# Altium schematic sheet STM32G431RBT6.SchDoc
size 304 x 254 mm; Organization: Efficient Power Conversion; Address1: 909 N. Pacific Coast Hwy. Ste 230; Address2: El Segundo, CA 90245; Address3: U.S.A.; Address4: www.epc-co.com; DocumentNumber: 1; Revision: 1; SheetNumber: 1; SheetTotal: 1
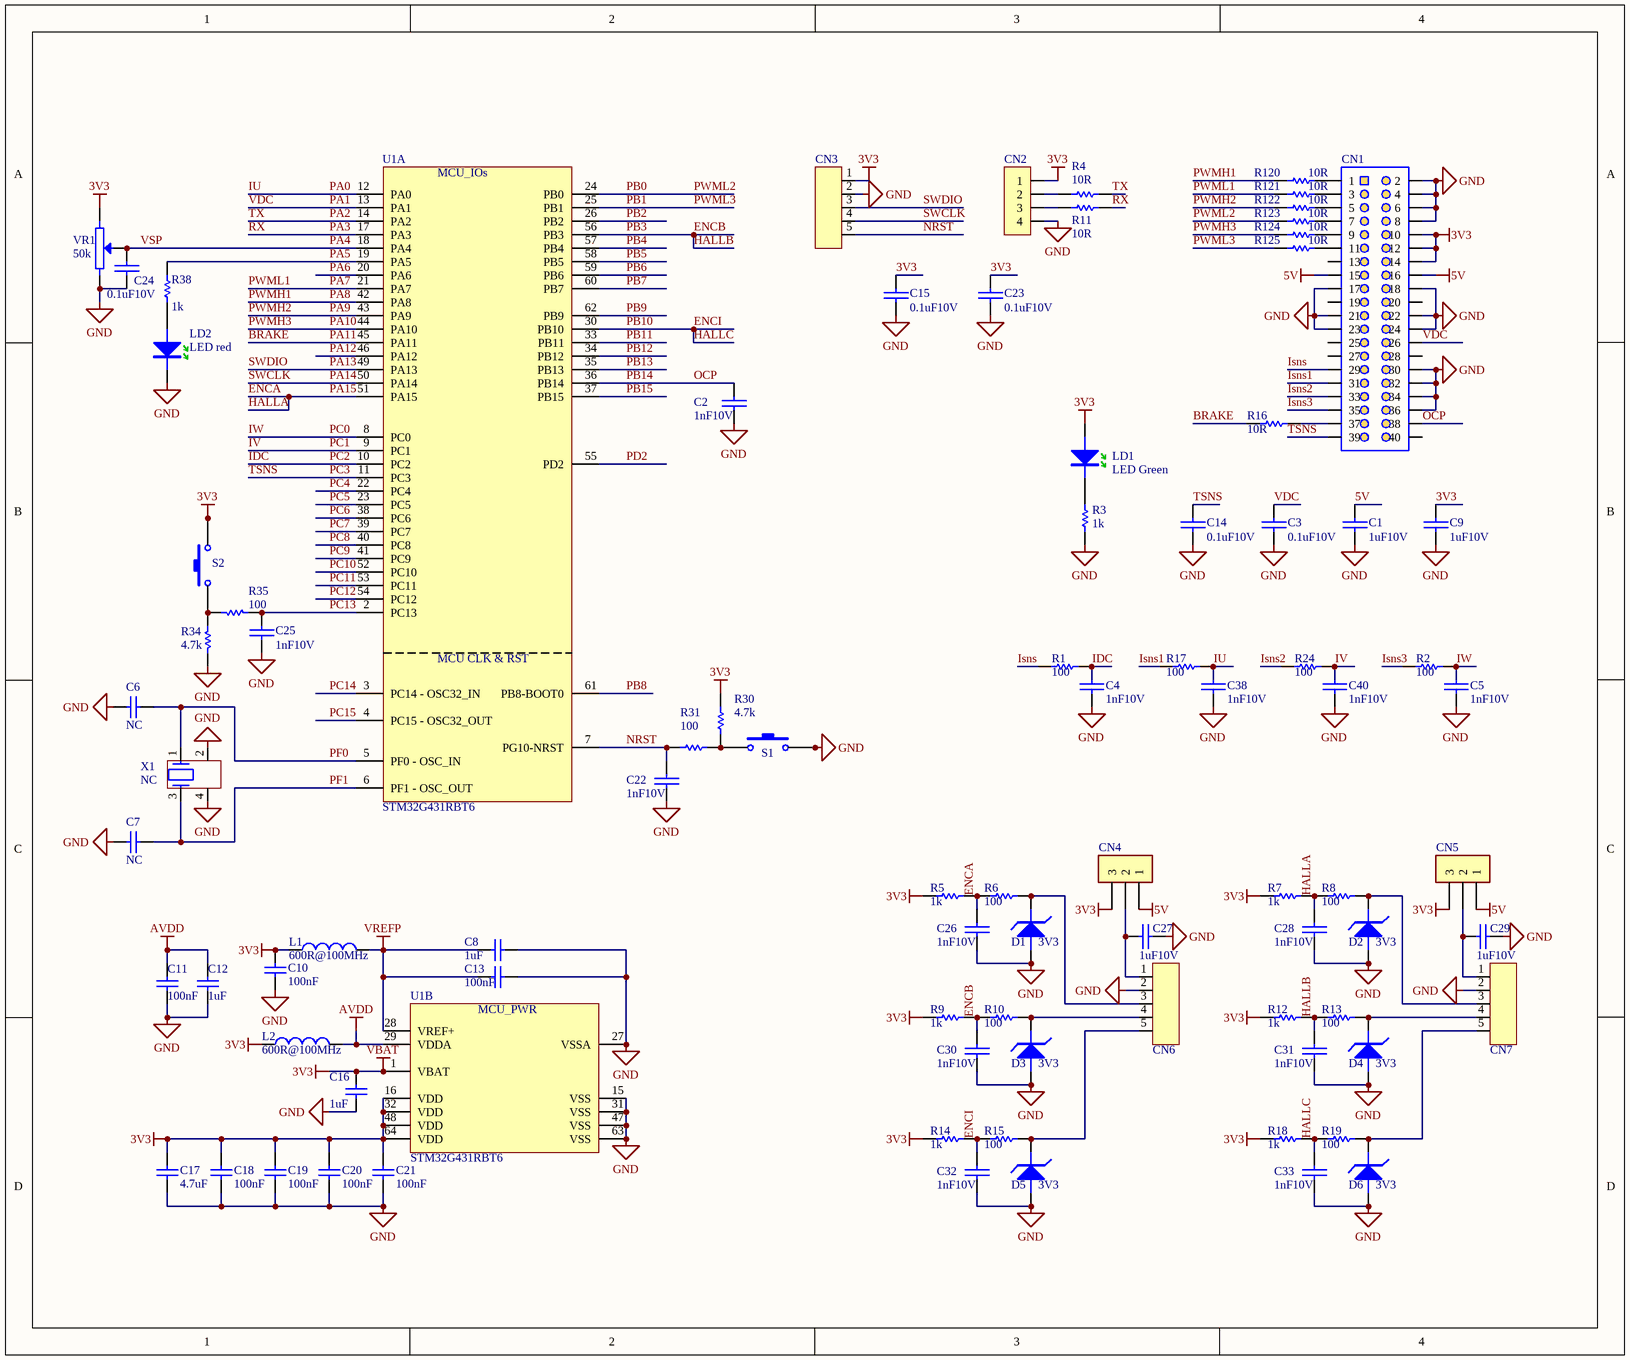
[diagram p0: STM32G431RBT6.SchDoc]

## Parts
C1  SchDescript: 1uF10V  [CC0603]  (hidden comment: UMK107AB7105KA-T)
C2  SchDescript: 1nF10V  [CC0402]  (hidden comment: C0402C102J5GACTU)
C3  SchDescript: 0.1uF10V  [CC0603]  (hidden comment: CC0402KRX7R8BB104)
C4  SchDescript: 1nF10V  [CC0402]  (hidden comment: C0402C102J5GACTU)
C5  SchDescript: 1nF10V  [CC0402]  (hidden comment: C0402C102J5GACTU)
C6  value NC  [CC0402]
C7  value NC  [CC0402]
C8  value 1uF  [CC0603]
C9  SchDescript: 1uF10V  [CC0603]  (hidden comment: UMK107AB7105KA-T)
C10  value 100nF  [CC0402]
C11  value 100nF  [CC0402]
C12  value 1uF  [CC0603]
C13  value 100nF  [CC0402]
C14  SchDescript: 0.1uF10V  [CC0603]  (hidden comment: CC0402KRX7R8BB104)
C15  SchDescript: 0.1uF10V  [CC0402]  (hidden comment: CC0402KRX7R8BB104)
C16  value 1uF  [CC0603]
C17  value 4.7uF  [CC0603]
C18  value 100nF  [CC0402]
C19  value 100nF  [CC0402]
C20  value 100nF  [CC0402]
C21  value 100nF  [CC0402]
C22  SchDescript: 1nF10V  [CC0402]  (hidden comment: CC0402KRX7R8BB104)
C23  SchDescript: 0.1uF10V  [CC0402]  (hidden comment: CC0402KRX7R8BB104)
C24  SchDescript: 0.1uF10V  [CC0402]  (hidden comment: CC0402KRX7R8BB104)
C25  SchDescript: 1nF10V  [CC0402]  (hidden comment: CC0402KRX7R8BB104)
C26  SchDescript: 1nF10V  [CC0402]  (hidden comment: C0402C102J5GACTU)
C27  1uF10V  [0603C]
C28  SchDescript: 1nF10V  [CC0402]  (hidden comment: C0402C102J5GACTU)
C29  1uF10V  [0603C]
C30  SchDescript: 1nF10V  [CC0402]  (hidden comment: C0402C102J5GACTU)
C31  SchDescript: 1nF10V  [CC0402]  (hidden comment: C0402C102J5GACTU)
C32  SchDescript: 1nF10V  [CC0402]  (hidden comment: C0402C102J5GACTU)
C33  SchDescript: 1nF10V  [CC0402]  (hidden comment: C0402C102J5GACTU)
C38  SchDescript: 1nF10V  [CC0402]  (hidden comment: C0402C102J5GACTU)
C40  SchDescript: 1nF10V  [CC0402]  (hidden comment: C0402C102J5GACTU)
CN1  SFH11-PBPC-D17-ST-BK  [HDR_F10_D17_TH_VT_Pol_Bot]  (value not drawn)
CN2  (no value)  [HDR_M10_S4_TH_VT]
CN3  2.54mm,5Pin  [PIN5]  (value not drawn)
CN4  (no value)  [PIN3_2.54mm]
CN5  (no value)  [PIN3_2.54mm]
CN6  2.54mm,5Pin  [PIN5]  (value not drawn)
CN7  2.54mm,5Pin  [PIN5]  (value not drawn)
D1  3V3  [1206D]
D2  3V3  [1206D]
D3  3V3  [1206D]
D4  3V3  [1206D]
D5  3V3  [1206D]
D6  3V3  [1206D]
L1  value 600R@100MHz  [RC0603]
L2  value 600R@100MHz  [RC0603]
LD1  value LED Green  [D0603]  (hidden comment: 150060VS75000)
LD2  value LED red  [D0603]  (hidden comment: 150060VS75000)
R1  SchDescript: 100  [RC0402]  (hidden comment: ERJ-2RKF1001X)
R2  SchDescript: 100  [RC0402]  (hidden comment: ERJ-2RKF1001X)
R3  SchDescript: 1k  [RC0402]  (hidden comment: ERJ-2RKF1001X)
R4  SchDescript: 10R  [RC0402]  (hidden comment: ERJ-2RKF1001X)
R5  SchDescript: 1k  [RC0402]  (hidden comment: ERJ-2RKF1001X)
R6  SchDescript: 100  [RC0402]  (hidden comment: ERJ-2RKF1001X)
R7  SchDescript: 1k  [RC0402]  (hidden comment: ERJ-2RKF1001X)
R8  SchDescript: 100  [RC0402]  (hidden comment: ERJ-2RKF1001X)
R9  SchDescript: 1k  [RC0402]  (hidden comment: ERJ-2RKF1001X)
R10  SchDescript: 100  [RC0402]  (hidden comment: ERJ-2RKF1001X)
R11  SchDescript: 10R  [RC0402]  (hidden comment: ERJ-2RKF1001X)
R12  SchDescript: 1k  [RC0402]  (hidden comment: ERJ-2RKF1001X)
R13  SchDescript: 100  [RC0402]  (hidden comment: ERJ-2RKF1001X)
R14  SchDescript: 1k  [RC0402]  (hidden comment: ERJ-2RKF1001X)
R15  SchDescript: 100  [RC0402]  (hidden comment: ERJ-2RKF1001X)
R16  SchDescript: 10R  [RC0402]  (hidden comment: ERJ-2RKF10R0X)
R17  SchDescript: 100  [RC0402]  (hidden comment: ERJ-2RKF1001X)
R18  SchDescript: 1k  [RC0402]  (hidden comment: ERJ-2RKF1001X)
R19  SchDescript: 100  [RC0402]  (hidden comment: ERJ-2RKF1001X)
R24  SchDescript: 100  [RC0402]  (hidden comment: ERJ-2RKF1001X)
R30  SchDescript: 4.7k  [RC0402]  (hidden comment: ERJ-2RKF1001X)
R31  SchDescript: 100  [RC0402]  (hidden comment: ERJ-2RKF1001X)
R34  SchDescript: 4.7k  [RC0402]  (hidden comment: ERJ-2RKF1001X)
R35  SchDescript: 100  [RC0402]  (hidden comment: ERJ-2RKF1001X)
R38  SchDescript: 1k  [RC0402]  (hidden comment: ERJ-2RKF1001X)
R120  SchDescript: 10R  [RC0402]  (hidden comment: ERJ-2RKF10R0X)
R121  SchDescript: 10R  [RC0402]  (hidden comment: ERJ-2RKF10R0X)
R122  SchDescript: 10R  [RC0402]  (hidden comment: ERJ-2RKF10R0X)
R123  SchDescript: 10R  [RC0402]  (hidden comment: ERJ-2RKF10R0X)
R124  SchDescript: 10R  [RC0402]  (hidden comment: ERJ-2RKF10R0X)
R125  SchDescript: 10R  [RC0402]  (hidden comment: ERJ-2RKF10R0X)
S1  SW-PB  [B3S-1000-4_V]  (value not drawn)
S2  SW-PB  [B3S-1000-4_V]  (value not drawn)
U1  value STM32G431RBT6  [ICC_LQFP64_10X10_P050_SOCKET_YAMAICHI_IC149-064-069-B5_NM]  (parts A,B of 2)
VR1  50k  [M63P]
X1  value NC  [CRY_NX2016SA_4P]

## Nets
3V3: C9.1 C10.2 C15.1 C16.2 C17.2 C18.2 C19.2 C20.2 C21.2 C23.1 CN1.10 CN1.12 CN1.14 CN2.1 CN3.1 CN4.3 CN5.3 L1.1 L2.1 LD1.A R5.1 R7.1 R9.1 R12.1 R14.1 R18.1 R30.1 S2.1 S2.2 U1.1(VBAT) U1.16(VDD) U1.32(VDD) U1.48(VDD) U1.64(VDD) VR1.1  [also labelled VBAT]
5V: C1.1 CN1.15 CN1.16 CN4.1 CN5.1
AVDD: C11.2 C12.2 L2.2 U1.29(VDDA)
GND: C1.2 C2.2 C3.2 C4.2 C5.2 C6.1 C7.1 C8.2 C9.2 C10.1 C11.1 C12.1 C13.2 C14.2 C15.2 C16.1 C17.1 C18.1 C19.1 C20.1 C21.1 C22.2 C23.2 C24.2 C25.2 C26.2 C27.2 C28.2 C29.2 C30.2 C31.2 C32.2 C33.2 C38.2 C40.2 CN1.2 CN1.4 CN1.6 CN1.8 CN1.17 CN1.18 CN1.21 CN1.22 CN1.23 CN1.24 CN1.30 CN1.32 CN1.34 CN1.36 CN2.4 CN3.2 CN6.2 CN7.2 D1.1(A) D2.1(A) D3.1(A) D4.1(A) D5.1(A) D6.1(A) LD2.K R3.1 R34.2 S1.3 S1.4 U1.15(VSS) U1.27(VSSA) U1.31(VSS) U1.47(VSS) U1.63(VSS) VR1.3 X1.2 X1.4
VREFP: C8.1 C13.1 L1.2 U1.28(VREF+)
BRAKE: R16.1 U1.45(PA11)  [also labelled PA11]
ENCA: C26.1 C28.1 R5.2 R6.1 R7.2 R8.1 U1.51(PA15)  [also labelled HALLA, PA15]
ENCB: C30.1 C31.1 R9.2 R10.1 R12.2 R13.1 U1.56(PB3)  [also labelled HALLB, PB3]
ENCI: C32.1 C33.1 R14.2 R15.1 R18.2 R19.1 U1.30(PB10)  [also labelled HALLC, PB10]
IDC: C4.1 R1.2 U1.10(PC2)  [also labelled PC2]
Isns: CN1.29 R1.1
Isns1: CN1.31 R17.1
Isns2: CN1.33 R24.1
Isns3: CN1.35 R2.1
IU: C38.1 R17.2 U1.12(PA0)  [also labelled PA0]
IV: C40.1 R24.2 U1.9(PC1)  [also labelled PC1]
IW: C5.1 R2.2 U1.8(PC0)  [also labelled PC0]
NRST: C22.1 CN3.5 R31.2 U1.7(PG10-NRST)
OCP: C2.1 CN1.38 U1.36(PB14)  [also labelled PB14]
PA1: C3.1 CN1.26 U1.13(PA1)  [also labelled VDC]
PA2: R4.1 U1.14(PA2)  [also labelled TX]
PA3: R11.1 U1.17(PA3)  [also labelled RX]
PA4: C24.1 U1.18(PA4) VR1.2  [also labelled VSP]
PA5: R38.2 U1.19(PA5)
PA6: U1.20(PA6)
PA7: R121.1 U1.21(PA7)  [also labelled PWML1]
PA8: R120.1 U1.42(PA8)  [also labelled PWMH1]
PA9: R122.1 U1.43(PA9)  [also labelled PWMH2]
PA10: R124.1 U1.44(PA10)  [also labelled PWMH3]
PA12: U1.46(PA12)
PA13: CN3.3 U1.49(PA13)  [also labelled SWDIO]
PA14: CN3.4 U1.50(PA14)  [also labelled SWCLK]
PB0: R123.1 U1.24(PB0)  [also labelled PWML2]
PB1: R125.1 U1.25(PB1)  [also labelled PWML3]
PB2: U1.26(PB2)
PB4: U1.57(PB4)
PB5: U1.58(PB5)
PB6: U1.59(PB6)
PB7: U1.60(PB7)
PB8: U1.61(PB8-BOOT0)
PB9: U1.62(PB9)
PB11: U1.33(PB11)
PB12: U1.34(PB12)
PB13: U1.35(PB13)
PB15: U1.37(PB15)
PC3: C14.1 CN1.39 U1.11(PC3)  [also labelled TSNS]
PC4: U1.22(PC4)
PC5: U1.23(PC5)
PC6: U1.38(PC6)
PC7: U1.39(PC7)
PC8: U1.40(PC8)
PC9: U1.41(PC9)
PC10: U1.52(PC10)
PC11: U1.53(PC11)
PC12: U1.54(PC12)
PC13: C25.1 R35.2 U1.2(PC13)
PC14: U1.3(PC14_-_OSC32_IN)
PC15: U1.4(PC15_-_OSC32_OUT)
PD2: U1.55(PD2)
PF0: C6.2 U1.5(PF0_-_OSC_IN) X1.1
PF1: C7.2 U1.6(PF1_-_OSC_OUT) X1.3
NetC27_1: C27.1 CN4.2 CN6.1
NetC29_1: C29.1 CN5.2 CN7.1
NetCN1_1: CN1.1 R120.2
NetCN1_3: CN1.3 R121.2
NetCN1_5: CN1.5 R122.2
NetCN1_7: CN1.7 R123.2
NetCN1_9: CN1.9 R124.2
NetCN1_11: CN1.11 R125.2
NetCN1_37: CN1.37 R16.2
NetCN2_2: CN2.2 R4.2
NetCN2_3: CN2.3 R11.2
NetCN6_3: CN6.3 D1.2(K) R6.2
NetCN6_4: CN6.4 D3.2(K) R10.2
NetCN6_5: CN6.5 D5.2(K) R15.2
NetCN7_3: CN7.3 D2.2(K) R8.2
NetCN7_4: CN7.4 D4.2(K) R13.2
NetCN7_5: CN7.5 D6.2(K) R19.2
NetLD1_K: LD1.K R3.2
NetLD2_A: LD2.A R38.1
NetR30_2: R30.2 R31.1 S1.1 S1.2
NetR34_1: R34.1 R35.1 S2.3 S2.4

Not connected (* = marked no-connect by the designer): CN1 13 19 20 25 27 28 40

## Notes on the sheet
- (in symbol MCD-01243, part A) MCU_IOs; MCU CLK & RST
- (in symbol MCD-01243, part B) MCU_PWR

## Library data of the parts
C1 C9 = C0603-10uF-50V-X7R-10%: QSGdescript: CAP CER 1UF 50V X7R 0603; Value: 10uF; Voltage: 50; Tolerance: 0.1; Tempco: X7R; Material: Ceramic; MFG: Taiyo Yuden; Part Number: C0603-10uF-50V-X7R-10%; MFGPN: UMK107AB7105KA-T
C2 C4 C5 C26 C28 C30-C33 C38 C40 = C0402-1nF-50V-C0G/NP0-5%: EPC Part Number: C-0402-024; QSGdescript: CAP CER 1000PF 50V C0G/NP0 0402; Value: 1nF; Voltage: 50; Tolerance: 0.05; Material: Ceramic; MFG: KEMET; Part Number: C0402-1nF-50V-C0G/NP0-5%; Tempco: C0G/NP0; MFGPN: C0402C102J5GACTU; Supplier 1: DigiKey; Supplier Part Number 1: 399-10034-1-ND; Supplier 2: DigiKey; Supplier Part Number 2: 399-10034-2-ND; Supplier 3: DigiKey; Supplier Part Number 3: 399-10034-6-ND
C3 C14 C15 C22-C25 = C0402-100nF-25V-X7R-10%-Yaego: EPC Part Number: C-0402-088; QSGdescript: CAP CER 0.1UF 25V X7R 0402; Value: 100nF; Voltage: 25; Tolerance: 0.1; Tempco: X7R; Material: Ceramic; MFG: Yageo; Part Number: C0402-100nF-25V-X7R-10%-Yaego; MFGPN: CC0402KRX7R8BB104; Supplier 1: DigiKey; Supplier Part Number 1: 311-2077-1-ND; Supplier 2: DigiKey; Supplier Part Number 2: 311-2077-2-ND; Supplier 3: DigiKey; Supplier Part Number 3: 311-2077-6-ND
C6 C7 = MCD-00674: Capacitor, MLCC, 6.8pF, 50V, NPO, +-0.25pF, 0402, T=0.5mm; Manufacturer_Part_Number: CC0402CRNPO9BN6R8; Manufacturer: YAGEO; Provided_By: SUBCO; Internal_Part_Number: MCD-00674; Status: Released; Part_Type: Capacitor; Package: C0402; ComponentLink1Description: Datasheet; ComponentLink1URL: http://tunmcdsvn.tun.st.com/Component_Datasheet_Library/Trunk/Capacitors/Yageo_Capacitor_NP0_16V-to-50V; ECCN_US: N/A; ECCN_EU: N/A
C8 C12 C16 = MCD-00010: Capacitor, MLCC, 1uF, 16V, X5R, 10%, 0603, T=0,8mm; Manufacturer_Part_Number: CC0603KRX5R7BB105; Manufacturer: YAGEO; Provided_By: Subcon; Initial_Board_Reference: MB1274; Internal_Part_Number: MCD-00010; Status: Released; Package: C0603; ComponentLink1Description: Yageo_Capacitor_X5R-series.pdf; ECCN_US: n/a; ECCN_EU: n/a; Part_Type: Capacitor; ComponentLink1URL: http://tunmcdsvn.tun.st.com/Component_Datasheet_Library/Trunk/Capacitors/Yageo_Multilayer_capacitor_X5R_series_100pF_to_100uF
C10 C11 C13 C18-C21 = MCD-00102: Capacitor, MLCC, 100nF, 16V, X7R, 10%, 0402, T=0,5mm; Manufacturer_Part_Number: CC0402KRX7R7BB104; Manufacturer: YAGEO; Provided_By: Subcon; Initial_Board_Reference: MB1262; Internal_Part_Number: MCD-00102; Status: Released; Package: C0402; ComponentLink1Description: Yageo_Capacitor_X7R-series.pdf; ECCN_US: n/a; ECCN_EU: n/a; Part_Type: Capacitor; ComponentLink1URL: http://tunmcdsvn.tun.st.com/Component_Datasheet_Library/Trunk/Capacitors/Yageo_Multilayer_Capacitor_X7R_series_100pF_to_22uF
C17 = MCD-00009: Capacitor, MLCC, 4.7uF, 16V, X5R, 10%, 0603, T=0.8mm; Manufacturer_Part_Number: CC0603KRX5R7BB475; Manufacturer: YAGEO; Provided_By: subcon; Initial_Board_Reference: MB1274; Internal_Part_Number: MCD-00009; ComponentLink1Description: Yageo_Capacitor_X5R-series.pdf; ECCN_US: n/a; ECCN_EU: n/a; Status: Released; Part_Type: Capacitor; Package: C0603; ComponentLink1URL: http://tunmcdsvn.tun.st.com/Component_Datasheet_Library/Trunk/Capacitors/Yageo_Multilayer_capacitor_X5R_series_100pF_to_100uF
C27 C29 = CAP0603: PCBfootprint: CC0603; MFG: TDK; MFGPN: C1608X7R1E105K
CN1 = HDR_F_D17_VT: 34pin Female Vertical polarized on BOTTOM; MFG: Sullins; Value: 34pinFemalePolarizedBottom; MFGPN: SFH11-PBPC-D17-ST-BK; Config: *; PCBfootprint: HDR_F10_D17_TH_VT_Pol_Bot
CN2 = PIN-1-4-254: Value: 2.54mm,4pin
CN3 CN6 CN7 = PIN-1-5-254: Value: 2.54mm,4pin
CN4 CN5 = CN3: CN
D1-D6 = Diode Zener: MFG: Diodes Inc.; MFGPN: BZT52C3V3T-7; Value: 3V3 300mW; PCBfootprint: SOD-523; Config: *
L1 L2 = MCD-00047: SMD Chip ferrite bead, 600R@100MHz +/-25%, 350mA, 500mohm DC, 0603, T=0.8mm; Part_Type: Inductor; Manufacturer_Part_Number: FCM1608KF-601T03; Manufacturer: TAI-TECH; Provided_By: SUBCO; Internal_Part_Number: MCD-00047; Status: Released; ComponentLink1Description: Datasheet; ComponentLink1URL: http://tunmcdsvn.tun.st.com/Component_Datasheet_Library/Trunk/Inductors/TaiTech_Bead_FCM1608_series; ECCN_US: n/a; ECCN_EU: n/a
LD1 LD2 = LED0603Gn: Green 570nm LED Indication - Discrete 2V 0603; PCBfootprint: DC0603; MFG: Wurth; Config: *; MFGPN: 150060VS75000
R1-R15 R17-R19 R24 R30 R31 R34 R35 R38 = R0402-1k-1%-0.1W-Thickfilm: EPC Part Number: R-0402-020; QSGdescript: RES SMD 1K OHM 1% 1/10W 0402; Value: 1k; Power Rating: 0.1; Tolerance: 0.01; MFG: Panasonic; Part Number: R0402-1k-1%-0.1W-Thickfilm; Material: Thick Film; MFGPN: ERJ-2RKF1001X; Supplier 1: DigiKey; Supplier Part Number 1: P1.00KLCT-ND; Supplier 2: DigiKey; Supplier Part Number 2: P1.00KLTR-ND; Supplier 3: DigiKey; Supplier Part Number 3: P1.00KLDKR-ND
R16 R120-R125 = R0402-10-1%-0.1W-ThickFilm: EPC Part Number: R-0402-015; QSGdescript: RES SMD 10 OHM 1% 1/10W 0402; Value: 10; Power Rating: 0.1; Tolerance: 0.01; MFG: Panasonic; Part Number: R0402-10-1%-0.1W-ThickFilm; Material: Thick Film; MFGPN: ERJ-2RKF10R0X; Supplier 1: DigiKey; Supplier Part Number 1: P10.0LCT-ND; Supplier 2: DigiKey; Supplier Part Number 2: P10.0LTR-ND; Supplier 3: DigiKey; Supplier Part Number 3: P10.0LDKR-ND
S1 S2 = SW-PB: Switch; Published: 24-Mar-1999; LatestRevisionDate: 17-Jul-2002; LatestRevisionNote: Re-released for DXP Platform.; PackageReference: SPST-2; Publisher: Altium Limited
U1 = MCD-01243: STM32G474, LQFP64 package,?3D IC footprint with 2D socket footprint.; Manufacturer_Part_Number: STM32G474RET6; Manufacturer: STMICROELECTRONICS; BMS_Part_Number: 9175326; Provided_By: SUBCO with ST control; ECCN_US: 3A991A2; ECCN_EU: NEC; Internal_Part_Number: MCD-01243; Status: Checked; Part_Type: IC; Package: LQFP64; ComponentLink1Description: Datasheet; ComponentLink1URL: http://tunmcdsvn.tun.st.com/Component_Datasheet_Library/Trunk/IC/STM_MCU_STM32G4xx
VR1 = RES可调: Potentiometer
X1 = MCD-01036: Crystal 24MHz, 6pF, +-20ppm, 80ohms max, SMD; Part_Type: Crystal_Osc; Manufacturer_Part_Number: NX2016SA 24MHz EXS00A-CS10820; Manufacturer: NDK; BMS_Part_Number: 9157045; ECCN_US: EAR99; ECCN_EU: NEC; Provided_By: SUBCO; Internal_Part_Number: MCD-01036; Status: Released; Package: (2016) 2.0 x 1.6 x 0.45 mm; ComponentLink1Description: Datasheet; ComponentLink1URL: http://tunmcdsvn.tun.st.com/Component_Datasheet_Library/Trunk/Crystal_Osc/NDK_NX2016SA 24MHz EXS00A-CS10820 (EXS10B-27366B); Order_Code_Digikey: 644-1365